# Altium project ATmega_2560_Pro.PrjPcb (part 2 of 4)
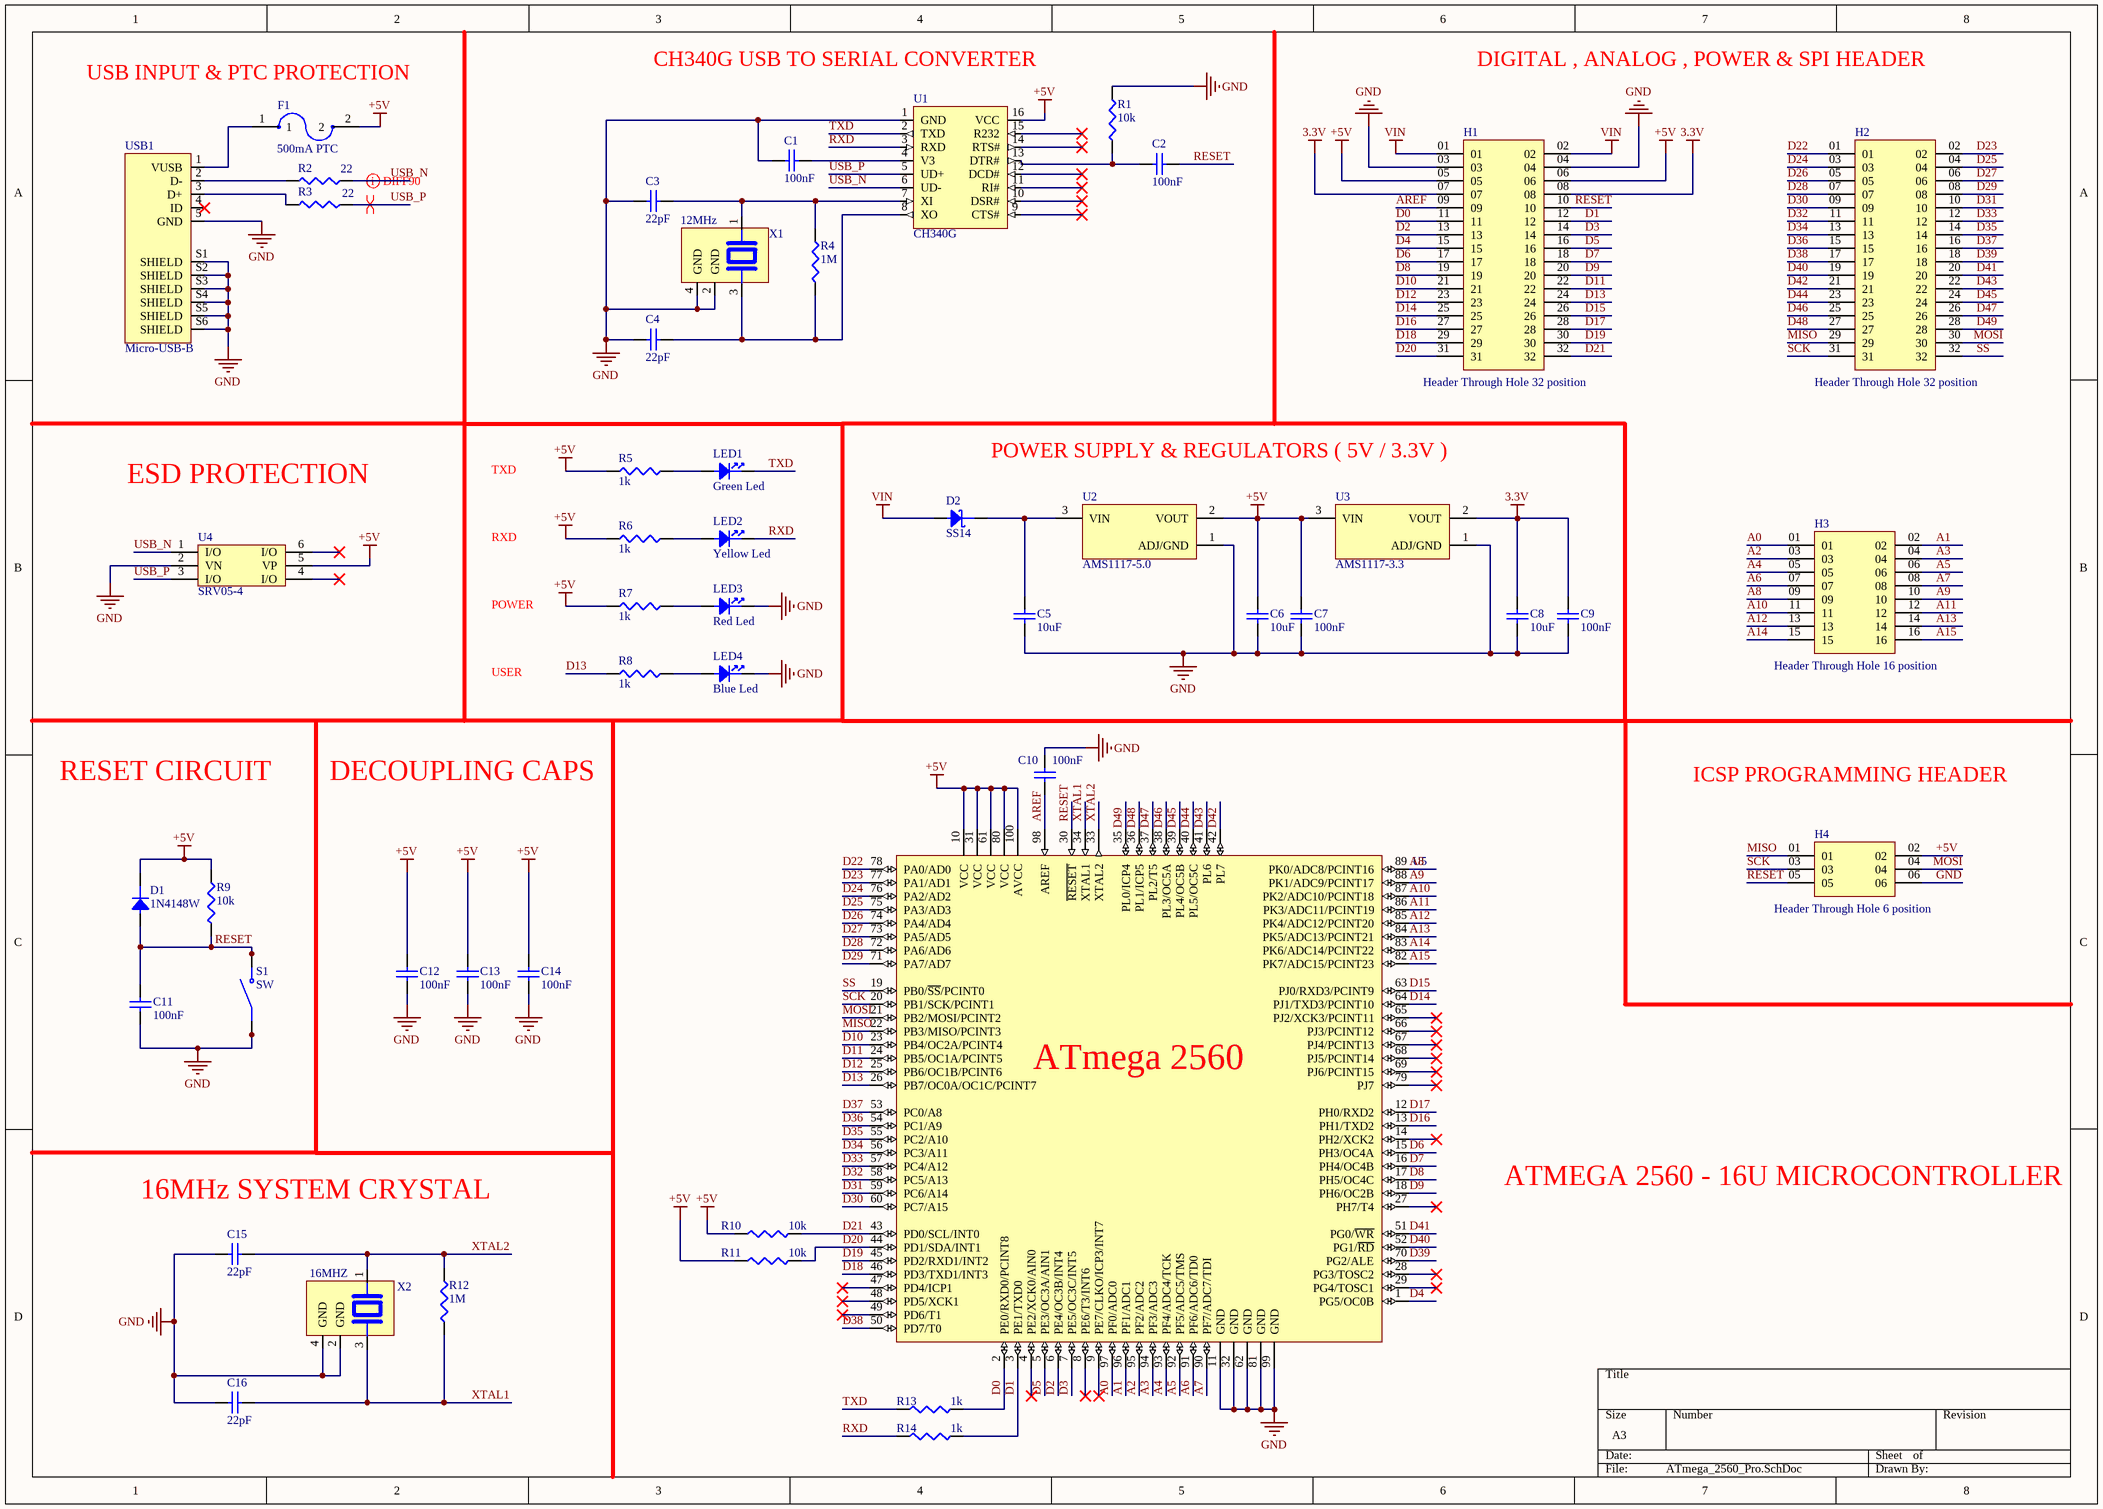
[diagram p1: ATmega_2560_Pro.SchDoc]

## Sheet ATmega_2560_Pro.SchDoc (continued)
### Library data of the parts
C1 C2 C7 C9-C14 = CC0603KRX7R9BB104: CAP CER 0.1UF 50V X7R 0603; Manufacturer 1: Yageo Group; Dielectric Material: Ceramic; Tolerance: 10%; Supplier 1: DigiKey; Manufacturer Part Number 1: CC0603KRX7R9BB104; Stock 1: 13983; Pricing 1: 1=0.14, 10=0.08, 50=0.0554, 100=0.0478, 500=0.03526 (USD); RoHS: Compliant; Value: 100nF; Case/Package: 0603; Case Code (Imperial): 0603; Case Code (Metric): 1608; China RoHS: Compliant; Country of Origin: Mainland China, Taiwan; Depth: 800µm; Dielectric: X7R; Export Control Classification Number (ECCN) Code: EAR99; Halogen Free: Halogen Free; Height: 800µm; Harmonized Tariff Schedule (HTS) Code: 8532.24.00.20; Introduction Date: 2005-08-18; Lead Free: Lead Free; Length: 1.6mm; Lifecycle Status: Production; Material: Ceramic; Max Operating Temperature: 125°C; Min Operating Temperature: -55°C; Mounting Technology: Surface Mount; Pins: 2; Number of Terminals: 2; Radiation Hardening: No; REACH SVHC: Unaffected; Schedule B: 8532240020, 8532240020|8532240020, 8532240020|8532240020|8532240020, 8532240020|8532240020|8532240020|8532240020; Termination: SMD/SMT; Thickness: 889µm; Voltage: 50V; Voltage Rating: 50V; Voltage Rating (DC): 50V; Width: 800µm; ComponentLink1URL: https://datasheet.octopart.com:443/CC0603KRX7R9BB104-Yageo-datasheet-177165144.pdf?src-supplier=IHS; ComponentLink1Description: https://datasheet.octopart.com:443/CC0603KRX7R9BB104-Yageo-datasheet-177165144.pdf?src-supplier=IHS; ComponentLink2URL: https://datasheet.octopart.com:443/CC0603KRX7R9BB104-Yageo-datasheet-82288757.pdf?src-supplier=Upverter; ComponentLink2Description: https://datasheet.octopart.com:443/CC0603KRX7R9BB104-Yageo-datasheet-82288757.pdf?src-supplier=Upverter; ComponentLink3URL: https://datasheet.octopart.com:443/CC0603KRX7R9BB104-Yageo-datasheet-68298032.pdf?src-supplier=Upverter; ComponentLink3Description: https://datasheet.octopart.com:443/CC0603KRX7R9BB104-Yageo-datasheet-68298032.pdf?src-supplier=Upverter; ComponentLink4URL: https://datasheet.octopart.com/CC0603KRX7R9BB104-Yageo-datasheet-10883670.pdf; ComponentLink4Description: https://datasheet.octopart.com/CC0603KRX7R9BB104-Yageo-datasheet-10883670.pdf; ComponentLink5URL: https://datasheet.octopart.com:443/CC0603KRX7R9BB104-Yageo-datasheet-181968726.pdf?src-supplier=Newark; ComponentLink5Description: https://datasheet.octopart.com:443/CC0603KRX7R9BB104-Yageo-datasheet-181968726.pdf?src-supplier=Newark; ComponentLink6URL: https://datasheet.octopart.com:443/CC0603KRX7R9BB104-Yageo-datasheet-499490.pdf?src-supplier=Newark; ComponentLink6Description: https://datasheet.octopart.com:443/CC0603KRX7R9BB104-Yageo-datasheet-499490.pdf?src-supplier=Newark; ComponentLink7URL: https://datasheet.octopart.com:443/CC0603KRX7R9BB104-Yageo-datasheet-62336348.pdf?src-supplier=Newark; ComponentLink7Description: https://datasheet.octopart.com:443/CC0603KRX7R9BB104-Yageo-datasheet-62336348.pdf?src-supplier=Newark; ComponentLink8URL: https://datasheet.octopart.com:443/CC0603KRX7R9BB104-Yageo-datasheet-147453679.pdf?src-supplier=Newark; ComponentLink8Description: https://datasheet.octopart.com:443/CC0603KRX7R9BB104-Yageo-datasheet-147453679.pdf?src-supplier=Newark; ComponentLink9URL: https://datasheet.octopart.com:443/CC0603KRX7R9BB104-Yageo-datasheet-151948686.pdf?src-supplier=Farnell; ComponentLink9Description: https://datasheet.octopart.com:443/CC0603KRX7R9BB104-Yageo-datasheet-151948686.pdf?src-supplier=Farnell; ComponentLink10URL: https://datasheet.octopart.com:443/CC0603KRX7R9BB104-Yageo-datasheet-500777.pdf?src-supplier=Farnell; ComponentLink10Description: https://datasheet.octopart.com:443/CC0603KRX7R9BB104-Yageo-datasheet-500777.pdf?src-supplier=Farnell; ComponentLink11URL: https://datasheet.octopart.com:443/CC0603KRX7R9BB104-Yageo-datasheet-12526321.pdf?src-supplier=Future+Electronics; ComponentLink11Description: https://datasheet.octopart.com:443/CC0603KRX7R9BB104-Yageo-datasheet-12526321.pdf?src-supplier=Future+Electronics; ComponentLink12URL: https://datasheet.octopart.com:443/CC0603KRX7R9BB104-Yageo-Group-datasheet-189192896.pdf?src-supplier=Future+Electronics; ComponentLink12Description: https://datasheet.octopart.com:443/CC0603KRX7R9BB104-Yageo-Group-datasheet-189192896.pdf?src-supplier=Future+Electronics; ComponentLink13URL: https://datasheet.octopart.com:443/CC0603KRX7R9BB104-Yageo-datasheet-166511530.pdf?src-supplier=Future+Electronics; ComponentLink13Description: https://datasheet.octopart.com:443/CC0603KRX7R9BB104-Yageo-datasheet-166511530.pdf?src-supplier=Future+Electronics; ComponentLink14URL: https://datasheet.octopart.com:443/CC0603KRX7R9BB104-Yageo-datasheet-137700082.pdf?src-supplier=Future+Electronics; ComponentLink14Description: https://datasheet.octopart.com:443/CC0603KRX7R9BB104-Yageo-datasheet-137700082.pdf?src-supplier=Future+Electronics; ComponentLink15URL: https://datasheet.octopart.com:443/CC0603KRX7R9BB104-Yageo-datasheet-137700084.pdf?src-supplier=Future+Electronics; ComponentLink15Description: https://datasheet.octopart.com:443/CC0603KRX7R9BB104-Yageo-datasheet-137700084.pdf?src-supplier=Future+Electronics; ComponentLink16URL: https://datasheet.octopart.com:443/CC0603KRX7R9BB104-Yageo-datasheet-27626582.pdf?src-supplier=Future+Electronics; ComponentLink16Description: https://datasheet.octopart.com:443/CC0603KRX7R9BB104-Yageo-datasheet-27626582.pdf?src-supplier=Future+Electronics; ComponentLink17URL: https://datasheet.octopart.com:443/CC0603KRX7R9BB104-Yageo-datasheet-15895757.pdf?src-supplier=Future+Electronics; ComponentLink17Description: https://datasheet.octopart.com:443/CC0603KRX7R9BB104-Yageo-datasheet-15895757.pdf?src-supplier=Future+Electronics; ComponentLink18URL: https://datasheet.octopart.com:443/CC0603KRX7R9BB104-Yageo-datasheet-8324192.pdf?src-supplier=Future+Electronics; ComponentLink18Description: https://datasheet.octopart.com:443/CC0603KRX7R9BB104-Yageo-datasheet-8324192.pdf?src-supplier=Future+Electronics; ComponentLink19URL: https://datasheet.octopart.com:443/CC0603KRX7R9BB104-Yageo-datasheet-178019014.pdf?src-supplier=Burklin+Elektronik; ComponentLink19Description: https://datasheet.octopart.com:443/CC0603KRX7R9BB104-Yageo-datasheet-178019014.pdf?src-supplier=Burklin+Elektronik; ComponentLink20URL: https://datasheet.octopart.com:443/CC0603KRX7R9BB104-Yageo-Group-datasheet-165992755.pdf?src-supplier=ODG+(Origin+Data+Global); ComponentLink20Description: https://datasheet.octopart.com:443/CC0603KRX7R9BB104-Yageo-Group-datasheet-165992755.pdf?src-supplier=ODG+(Origin+Data+Global); ComponentLink21URL: https://datasheet.octopart.com:443/CC0603KRX7R9BB104-Yageo-datasheet-140260305.pdf?src-supplier=SOS+electronic; ComponentLink21Description: https://datasheet.octopart.com:443/CC0603KRX7R9BB104-Yageo-datasheet-140260305.pdf?src-supplier=SOS+electronic; ComponentLink22URL: https://datasheet.octopart.com:443/CC0603KRX7R9BB104-Yageo-datasheet-120101875.pdf?src-supplier=Megastar; ComponentLink22Description: https://datasheet.octopart.com:443/CC0603KRX7R9BB104-Yageo-datasheet-120101875.pdf?src-supplier=Megastar; ComponentLink23URL: https://datasheet.octopart.com:443/CC0603KRX7R9BB104-Yageo-datasheet-8701427.pdf?src-supplier=element14; ComponentLink23Description: https://datasheet.octopart.com:443/CC0603KRX7R9BB104-Yageo-datasheet-8701427.pdf?src-supplier=element14; ComponentLink24URL: https://datasheet.octopart.com:443/CC0603KRX7R9BB104-Yageo-datasheet-5301394.pdf?src-supplier=element14; ComponentLink24Description: https://datasheet.octopart.com:443/CC0603KRX7R9BB104-Yageo-datasheet-5301394.pdf?src-supplier=element14; ComponentLink25URL: https://datasheet.octopart.com:443/CC0603KRX7R9BB104-Yageo-datasheet-17600895.pdf?src-supplier=TME; ComponentLink25Description: https://datasheet.octopart.com:443/CC0603KRX7R9BB104-Yageo-datasheet-17600895.pdf?src-supplier=TME; ComponentLink26URL: http://sigma.octopart.com:80/15889575/rohs_statement/Yageo-CC0603KRX7R9BB104.pdf?src-supplier=Compliance+Statements; ComponentLink26Description: http://sigma.octopart.com:80/15889575/rohs_statement/Yageo-CC0603KRX7R9BB104.pdf?src-supplier=Compliance+Statements; ComponentLink27URL: http://sigma.octopart.com:80/conflict_mineral_statement/Yageo-company-3.pdf?src-supplier=Compliance+Statements; ComponentLink27Description: http://sigma.octopart.com:80/conflict_mineral_statement/Yageo-company-3.pdf?src-supplier=Compliance+Statements; Supplier Part Number 1: 311-1344-6-ND
C3 C4 C15 C16 = CC0603JRNPO9BN220: CAP CER 22PF 50V C0G/NPO 0603; Manufacturer 1: Yageo Group; Dielectric: C0G; Dielectric Material: Ceramic; Temperature Coefficient: 30ppm/°C; Tolerance: 5%; Supplier 1: DigiKey; Manufacturer Part Number 1: CC0603JRNPO9BN220; Stock 1: 876; Pricing 1: 1=0.11, 10=0.057, 50=0.039, 100=0.0334, 500=0.02416 (USD); RoHS: Compliant; Value: 22pF; Case/Package: 0603; Case Code (Imperial): 0603; Case Code (Metric): 1608; China RoHS: Compliant; Country of Origin: Mainland China, Taiwan; Depth: 800µm; Export Control Classification Number (ECCN) Code: EAR99; Halogen Free: Halogen Free; Height: 800µm; Harmonized Tariff Schedule (HTS) Code: 8532.24.00.20; Introduction Date: 2003-08-13; Lead Free: Lead Free; Length: 1.6mm; Lifecycle Status: Production; Max Operating Temperature: 125°C; Min Operating Temperature: -55°C; Mounting Technology: Surface Mount; Pins: 2; Number of Terminals: 2; Radiation Hardening: No; REACH SVHC: Unaffected; Schedule B: 8532240020, 8532240020|8532240020, 8532240020|8532240020|8532240020, 8532240020|8532240020|8532240020|8532240020; Termination: SMD/SMT; Thickness: 889µm; Voltage: 50V; Voltage Rating: 50V; Voltage Rating (AC): 50V; Voltage Rating (DC): 50V; Width: 800µm; ComponentLink1URL: https://datasheet.octopart.com:443/CC0603JRNPO9BN220-Yageo-datasheet-182140217.pdf?src-supplier=IHS; ComponentLink1Description: https://datasheet.octopart.com:443/CC0603JRNPO9BN220-Yageo-datasheet-182140217.pdf?src-supplier=IHS; ComponentLink2URL: https://datasheet.octopart.com:443/CC0603JRNPO9BN220-Yageo-datasheet-10406438.pdf?src-supplier=element14+APAC; ComponentLink2Description: https://datasheet.octopart.com:443/CC0603JRNPO9BN220-Yageo-datasheet-10406438.pdf?src-supplier=element14+APAC; ComponentLink3URL: https://datasheet.octopart.com:443/CC0603JRNPO9BN220-Yageo-datasheet-10882999.pdf?src-supplier=element14+APAC; ComponentLink3Description: https://datasheet.octopart.com:443/CC0603JRNPO9BN220-Yageo-datasheet-10882999.pdf?src-supplier=element14+APAC; ComponentLink4URL: https://datasheet.octopart.com:443/CC0603JRNPO9BN220-Yageo-datasheet-78855684.pdf?src-supplier=Upverter; ComponentLink4Description: https://datasheet.octopart.com:443/CC0603JRNPO9BN220-Yageo-datasheet-78855684.pdf?src-supplier=Upverter; ComponentLink5URL: https://datasheet.octopart.com:443/CC0603JRNPO9BN220-Yageo---Phycomp-datasheet-141445762.pdf?src-supplier=Upverter; ComponentLink5Description: https://datasheet.octopart.com:443/CC0603JRNPO9BN220-Yageo---Phycomp-datasheet-141445762.pdf?src-supplier=Upverter; ComponentLink6URL: https://datasheet.octopart.com:443/CC0603JRNPO9BN220-Yageo-Group-datasheet-192360829.pdf?src-supplier=Future+Electronics; ComponentLink6Description: https://datasheet.octopart.com:443/CC0603JRNPO9BN220-Yageo-Group-datasheet-192360829.pdf?src-supplier=Future+Electronics; ComponentLink7URL: https://datasheet.octopart.com:443/CC0603JRNPO9BN220-Yageo-datasheet-12589826.pdf?src-supplier=Future+Electronics; ComponentLink7Description: https://datasheet.octopart.com:443/CC0603JRNPO9BN220-Yageo-datasheet-12589826.pdf?src-supplier=Future+Electronics; ComponentLink8URL: https://datasheet.octopart.com:443/CC0603JRNPO9BN220-Yageo-datasheet-137875056.pdf?src-supplier=Future+Electronics; ComponentLink8Description: https://datasheet.octopart.com:443/CC0603JRNPO9BN220-Yageo-datasheet-137875056.pdf?src-supplier=Future+Electronics; ComponentLink9URL: https://datasheet.octopart.com:443/CC0603JRNPO9BN220-Yageo-datasheet-136957424.pdf?src-supplier=Future+Electronics; ComponentLink9Description: https://datasheet.octopart.com:443/CC0603JRNPO9BN220-Yageo-datasheet-136957424.pdf?src-supplier=Future+Electronics; ComponentLink10URL: https://datasheet.octopart.com:443/CC0603JRNPO9BN220-Yageo-datasheet-137700082.pdf?src-supplier=Future+Electronics; ComponentLink10Description: https://datasheet.octopart.com:443/CC0603JRNPO9BN220-Yageo-datasheet-137700082.pdf?src-supplier=Future+Electronics; ComponentLink11URL: https://datasheet.octopart.com:443/CC0603JRNPO9BN220-Yageo-datasheet-62091628.pdf?src-supplier=Future+Electronics; ComponentLink11Description: https://datasheet.octopart.com:443/CC0603JRNPO9BN220-Yageo-datasheet-62091628.pdf?src-supplier=Future+Electronics; ComponentLink12URL: https://datasheet.octopart.com:443/CC0603JRNPO9BN220-Yageo-datasheet-16730043.pdf?src-supplier=Future+Electronics; ComponentLink12Description: https://datasheet.octopart.com:443/CC0603JRNPO9BN220-Yageo-datasheet-16730043.pdf?src-supplier=Future+Electronics; ComponentLink13URL: https://datasheet.octopart.com:443/CC0603JRNPO9BN220-Yageo-datasheet-15895757.pdf?src-supplier=Future+Electronics; ComponentLink13Description: https://datasheet.octopart.com:443/CC0603JRNPO9BN220-Yageo-datasheet-15895757.pdf?src-supplier=Future+Electronics; ComponentLink14URL: https://datasheet.octopart.com:443/CC0603JRNPO9BN220-Yageo-datasheet-151948684.pdf?src-supplier=Newark; ComponentLink14Description: https://datasheet.octopart.com:443/CC0603JRNPO9BN220-Yageo-datasheet-151948684.pdf?src-supplier=Newark; ComponentLink15URL: https://datasheet.octopart.com:443/CC0603JRNPO9BN220-Phycomp-datasheet-504625.pdf?src-supplier=Newark; ComponentLink15Description: https://datasheet.octopart.com:443/CC0603JRNPO9BN220-Phycomp-datasheet-504625.pdf?src-supplier=Newark; ComponentLink16URL: https://datasheet.octopart.com:443/CC0603JRNPO9BN220-Yageo-datasheet-181968203.pdf?src-supplier=Newark; ComponentLink16Description: https://datasheet.octopart.com:443/CC0603JRNPO9BN220-Yageo-datasheet-181968203.pdf?src-supplier=Newark; ComponentLink17URL: https://datasheet.octopart.com:443/CC0603JRNPO9BN220-Yageo-datasheet-24578986.pdf?src-supplier=Newark; ComponentLink17Description: https://datasheet.octopart.com:443/CC0603JRNPO9BN220-Yageo-datasheet-24578986.pdf?src-supplier=Newark; ComponentLink18URL: https://datasheet.octopart.com:443/CC0603JRNPO9BN220-Yageo-datasheet-67645495.pdf?src-supplier=Newark; ComponentLink18Description: https://datasheet.octopart.com:443/CC0603JRNPO9BN220-Yageo-datasheet-67645495.pdf?src-supplier=Newark; ComponentLink19URL: https://datasheet.octopart.com:443/CC0603JRNPO9BN220-Yageo-datasheet-65873193.pdf?src-supplier=Farnell; ComponentLink19Description: https://datasheet.octopart.com:443/CC0603JRNPO9BN220-Yageo-datasheet-65873193.pdf?src-supplier=Farnell; ComponentLink20URL: https://datasheet.octopart.com:443/CC0603JRNPO9BN220-Yageo-Group-datasheet-188689597.pdf?src-supplier=Farnell; ComponentLink20Description: https://datasheet.octopart.com:443/CC0603JRNPO9BN220-Yageo-Group-datasheet-188689597.pdf?src-supplier=Farnell; ComponentLink21URL: https://datasheet.octopart.com:443/CC0603JRNPO9BN220-Yageo-datasheet-8817079.pdf?src-supplier=element14; ComponentLink21Description: https://datasheet.octopart.com:443/CC0603JRNPO9BN220-Yageo-datasheet-8817079.pdf?src-supplier=element14; ComponentLink22URL: https://datasheet.octopart.com:443/CC0603JRNPO9BN220-Yageo-datasheet-8324240.pdf?src-supplier=element14; ComponentLink22Description: https://datasheet.octopart.com:443/CC0603JRNPO9BN220-Yageo-datasheet-8324240.pdf?src-supplier=element14; ComponentLink23URL: https://datasheet.octopart.com:443/CC0603JRNPO9BN220-Yageo-datasheet-5321569.pdf?src-supplier=element14; ComponentLink23Description: https://datasheet.octopart.com:443/CC0603JRNPO9BN220-Yageo-datasheet-5321569.pdf?src-supplier=element14; ComponentLink24URL: https://datasheet.octopart.com:443/CC0603JRNPO9BN220-Yageo-datasheet-8643175.pdf?src-supplier=SOS+electronic; ComponentLink24Description: https://datasheet.octopart.com:443/CC0603JRNPO9BN220-Yageo-datasheet-8643175.pdf?src-supplier=SOS+electronic; ComponentLink25URL: https://datasheet.octopart.com:443/CC0603JRNPO9BN220-Yageo-datasheet-8555986.pdf?src-supplier=TME; ComponentLink25Description: https://datasheet.octopart.com:443/CC0603JRNPO9BN220-Yageo-datasheet-8555986.pdf?src-supplier=TME; ComponentLink26URL: https://datasheet.octopart.com:443/CC0603JRNPO9BN220-Yageo-datasheet-68296204.pdf?src-supplier=Megastar; ComponentLink26Description: https://datasheet.octopart.com:443/CC0603JRNPO9BN220-Yageo-datasheet-68296204.pdf?src-supplier=Megastar; ComponentLink27URL: http://sigma.octopart.com:80/conflict_mineral_statement/Yageo-company-3.pdf?src-supplier=Compliance+Statements; ComponentLink27Description: http://sigma.octopart.com:80/conflict_mineral_statement/Yageo-company-3.pdf?src-supplier=Compliance+Statements; ComponentLink28URL: http://sigma.octopart.com:80/rohs_statement/Yageo-company-2.pdf?src-supplier=Compliance+Statements; ComponentLink28Description: http://sigma.octopart.com:80/rohs_statement/Yageo-company-2.pdf?src-supplier=Compliance+Statements; Supplier Part Number 1: 311-1062-1-ND
C5 C6 C8 = CC0603MRX5R6BB106: CAP CER 10UF 10V X5R 0603; Manufacturer: Yageo Group; Value: 10µF; Dielectric Material: Ceramic; Tolerance: 20%; Supplier: DigiKey; Supplier Part Number: 311-1817-1-ND; Manufacturer Part Number: CC0603MRX5R6BB106; RoHS: Compliant; Category: Ceramic Capacitors; Stock: 2; Pricing: 1=0.43, 10=0.252, 50=0.1838, 100=0.1629, 500=0.12756 (USD); Case/Package: 0603; Case Code (Imperial): 0603; Case Code (Metric): 1608; China RoHS: Compliant; Composition: Ceramic; Country of Origin: Mainland China, Taiwan; Depth: 800µm; Dielectric: X5R; Export Control Classification Number (ECCN) Code: EAR99; Halogen Free: Halogen Free; Height: 800µm; Harmonized Tariff Schedule (HTS) Code: 8532.24.00.20; Introduction Date: 2013-02-05; Lead Free: Lead Free; Length: 1.6mm; Lifecycle Status: Production; Max Operating Temperature: 85°C; Min Operating Temperature: -55°C; Mounting Technology: Surface Mount; Number of Terminals: 2; Packaging: Tape and Reel; REACH SVHC: Unaffected; Schedule B: 8532240020, 8532240020|8532240020|8532240020|8532240020|8532240020|8532240020|8532240020|8532240020|8532240020|8532240020|8532240020|8532240020|8532240020|8532240020|8532240020, 8532240020|8532240020|8532240020|8532240020|8532240020|8532240020|8532240020|8532240020|8532240020|8532240020|8532240020|8532240020|8532240020|8532240020|8532240020|8532240020, 8532240020|8532240020|8532240020|8532240020|8532240020|8532240020|8532240020|8532240020|8532240020|8532240020|8532240020|8532240020|8532240020|8532240020|8532240020|8532240020|8532240020; Termination: SMD/SMT; Thickness: 889µm; Voltage Rating: 10V; Voltage Rating (DC): 10V; Weight: 2.012816mg; Width: 800µm; ComponentLink1URL: https://datasheet.octopart.com:443/CC0603MRX5R6BB106-Yageo-datasheet-170350636.pdf?src-supplier=IHS; ComponentLink1Description: https://datasheet.octopart.com:443/CC0603MRX5R6BB106-Yageo-datasheet-170350636.pdf?src-supplier=IHS; ComponentLink2URL: https://datasheet.octopart.com:443/CC0603MRX5R6BB106-Yageo-datasheet-181968810.pdf?src-supplier=Farnell; ComponentLink2Description: https://datasheet.octopart.com:443/CC0603MRX5R6BB106-Yageo-datasheet-181968810.pdf?src-supplier=Farnell; ComponentLink3URL: https://datasheet.octopart.com:443/CC0603MRX5R6BB106-Yageo-datasheet-181968808.pdf?src-supplier=Farnell; ComponentLink3Description: https://datasheet.octopart.com:443/CC0603MRX5R6BB106-Yageo-datasheet-181968808.pdf?src-supplier=Farnell; ComponentLink4URL: https://datasheet.octopart.com/CC0603MRX5R6BB106-Yageo-datasheet-86397281.pdf; ComponentLink4Description: https://datasheet.octopart.com/CC0603MRX5R6BB106-Yageo-datasheet-86397281.pdf; ComponentLink5URL: https://datasheet.octopart.com:443/CC0603MRX5R6BB106-Yageo-Group-datasheet-184398209.pdf?src-supplier=LCSC; ComponentLink5Description: https://datasheet.octopart.com:443/CC0603MRX5R6BB106-Yageo-Group-datasheet-184398209.pdf?src-supplier=LCSC; ComponentLink6URL: https://datasheet.octopart.com:443/CC0603MRX5R6BB106-Yageo-Group-datasheet-175963154.pdf?src-supplier=Newark; ComponentLink6Description: https://datasheet.octopart.com:443/CC0603MRX5R6BB106-Yageo-Group-datasheet-175963154.pdf?src-supplier=Newark; ComponentLink7URL: https://datasheet.octopart.com:443/CC0603MRX5R6BB106-Yageo-datasheet-158238148.pdf?src-supplier=Newark; ComponentLink7Description: https://datasheet.octopart.com:443/CC0603MRX5R6BB106-Yageo-datasheet-158238148.pdf?src-supplier=Newark; ComponentLink8URL: https://datasheet.octopart.com:443/CC0603MRX5R6BB106-Yageo-Group-datasheet-145016144.pdf?src-supplier=ODG+(Origin+Data+Global); ComponentLink8Description: https://datasheet.octopart.com:443/CC0603MRX5R6BB106-Yageo-Group-datasheet-145016144.pdf?src-supplier=ODG+(Origin+Data+Global); ComponentLink9URL: https://datasheet.octopart.com:443/CC0603MRX5R6BB106-Yageo-datasheet-137700082.pdf?src-supplier=Future+Electronics; ComponentLink9Description: https://datasheet.octopart.com:443/CC0603MRX5R6BB106-Yageo-datasheet-137700082.pdf?src-supplier=Future+Electronics; ComponentLink10URL: https://datasheet.octopart.com:443/CC0603MRX5R6BB106-Yageo-datasheet-78855687.pdf?src-supplier=Future+Electronics; ComponentLink10Description: https://datasheet.octopart.com:443/CC0603MRX5R6BB106-Yageo-datasheet-78855687.pdf?src-supplier=Future+Electronics; ComponentLink11URL: https://datasheet.octopart.com:443/CC0603MRX5R6BB106-Yageo-Group-datasheet-192360830.pdf?src-supplier=Future+Electronics; ComponentLink11Description: https://datasheet.octopart.com:443/CC0603MRX5R6BB106-Yageo-Group-datasheet-192360830.pdf?src-supplier=Future+Electronics; ComponentLink12URL: http://sigma.octopart.com:80/conflict_mineral_statement/Yageo-company-3.pdf?src-supplier=Compliance+Statements; ComponentLink12Description: http://sigma.octopart.com:80/conflict_mineral_statement/Yageo-company-3.pdf?src-supplier=Compliance+Statements; ComponentLink13URL: http://sigma.octopart.com:80/rohs_statement/Yageo-company-2.pdf?src-supplier=Compliance+Statements; ComponentLink13Description: http://sigma.octopart.com:80/rohs_statement/Yageo-company-2.pdf?src-supplier=Compliance+Statements
D1 = 1N4148W: DIODE STANDARD 75V 250MA SOD123; Manufacturer 1: Sangdest Microelectronics; Max Output current: 150mA; Max Power Dissipation: 410mW; Number of Elements: 1; Reverse Recovery Time: 4ns; Supplier 1: DigiKey; Manufacturer Part Number 1: 1N4148W; Stock 1: 266309; Pricing 1: 1=0.14, 10=0.083, 50=0.0592, 100=0.0512, 500=0.03694 (USD); RoHS: Compliant; Country of Origin: Mainland China; Export Control Classification Number (ECCN) Code: EAR99; Harmonized Tariff Schedule (HTS) Code: 8541.10.00.70; Introduction Date: 2003-01-15; Lifecycle Status: Production; Max Operating Temperature: 150°C; Number of Terminals: 2; REACH SVHC: Unaffected; Reverse Standoff Voltage: 75V; ComponentLink1URL: https://datasheet.octopart.com:443/1N4148W-SMC-Diode-Solutions-datasheet-181398799.pdf?src-supplier=IHS; ComponentLink1Description: https://datasheet.octopart.com:443/1N4148W-SMC-Diode-Solutions-datasheet-181398799.pdf?src-supplier=IHS; Supplier Part Number 1: 1655-1N4148WCT-ND
D2 = SS14: DIODE SCHOTTKY 40V 1A DO214AC; Manufacturer: Taiwan Semiconductor; Manufacturer Lifecycle Status: ACTIVE; Element Configuration: Single; Forward Voltage: 500mV; Max Forward Surge Current (Ifsm): 40A; Max Junction Temperature (Tj): 125°C; Max Reverse Leakage Current: 200µA; Max Surge Current: 30A; Number of Elements: 1; Polarity: Standard; Power Dissipation: 400mW; Reverse Recovery Time: 25ns; Supplier: DigiKey; Supplier Part Number: 1801-SS14CT-ND; Manufacturer Part Number: SS14; RoHS: Compliant; Category: Schottky Diodes; Stock: 63885; Pricing: 1=0.39, 10=0.236, 50=0.1698, 100=0.148, 500=0.1096 (USD); Case/Package: SMA; China RoHS: Non-Compliant; Contact Plating: Tin; Country of Origin: Mainland China, Taiwan; Current Rating: 1A; Export Control Classification Number (ECCN) Code: EAR99; Forward Current: 1A; Harmonized Tariff Schedule (HTS) Code: 8541.10.00.80; Introduction Date: 1998-01-20; Lead Free: Lead Free; Lifecycle Status: Production; Max Operating Temperature: 125°C; Max Output current: 1A; Max Repetitive Reverse Voltage (Vrrm): 40V; Min Breakdown Voltage: 40V; Min Operating Temperature: -65°C; Mounting Technology: Surface Mount; Pins: 2; Number of Terminals: 2; Output Current: 1A; Packaging: Cut Tape; Peak Non-Repetitive Surge Current: 30A; Peak Reverse Current: 200µA; REACH SVHC: Affected; Reverse Standoff Voltage: 40V; Schedule B: 8541100080, 8541100080|8541100080|8541100080|8541100080|8541100080; Voltage Rating (DC): 40V; ComponentLink1URL: https://datasheet.octopart.com:443/SS14-Taiwan-Semiconductor-datasheet-179284502.pdf?src-supplier=IHS; ComponentLink1Description: https://datasheet.octopart.com:443/SS14-Taiwan-Semiconductor-datasheet-179284502.pdf?src-supplier=IHS; ComponentLink2URL: https://datasheet.octopart.com:443/SS14-Taiwan-Semiconductor-datasheet-181551144.pdf?src-supplier=IHS; ComponentLink2Description: https://datasheet.octopart.com:443/SS14-Taiwan-Semiconductor-datasheet-181551144.pdf?src-supplier=IHS; ComponentLink3URL: https://datasheet.octopart.com:443/SS14-Taiwan-Semiconductor-datasheet-180789182.pdf?src-supplier=IHS; ComponentLink3Description: https://datasheet.octopart.com:443/SS14-Taiwan-Semiconductor-datasheet-180789182.pdf?src-supplier=IHS; ComponentLink4URL: https://datasheet.octopart.com:443/SS14-Taiwan-Semiconductor-datasheet-182397600.pdf?src-supplier=IHS; ComponentLink4Description: https://datasheet.octopart.com:443/SS14-Taiwan-Semiconductor-datasheet-182397600.pdf?src-supplier=IHS; ComponentLink5URL: https://datasheet.octopart.com:443/SS14-Taiwan-Semiconductor-datasheet-68472387.pdf?src-supplier=Taiwan+Semiconductor; ComponentLink5Description: https://datasheet.octopart.com:443/SS14-Taiwan-Semiconductor-datasheet-68472387.pdf?src-supplier=Taiwan+Semiconductor; ComponentLink6URL: https://datasheet.octopart.com:443/SS14-Taiwan-Semiconductor-datasheet-34355587.pdf?src-supplier=Taiwan+Semiconductor; ComponentLink6Description: https://datasheet.octopart.com:443/SS14-Taiwan-Semiconductor-datasheet-34355587.pdf?src-supplier=Taiwan+Semiconductor; ComponentLink7URL: https://datasheet.octopart.com:443/SS14-Taiwan-Semiconductor-datasheet-152739498.pdf?src-supplier=Farnell; ComponentLink7Description: https://datasheet.octopart.com:443/SS14-Taiwan-Semiconductor-datasheet-152739498.pdf?src-supplier=Farnell; ComponentLink8URL: https://datasheet.octopart.com:443/SS14-Taiwan-Semiconductor-datasheet-13727340.pdf?src-supplier=Newark; ComponentLink8Description: https://datasheet.octopart.com:443/SS14-Taiwan-Semiconductor-datasheet-13727340.pdf?src-supplier=Newark; ComponentLink9URL: https://datasheet.octopart.com:443/SS14-Taiwan-Semiconductor-datasheet-11549383.pdf?src-supplier=JRH+Electronics; ComponentLink9Description: https://datasheet.octopart.com:443/SS14-Taiwan-Semiconductor-datasheet-11549383.pdf?src-supplier=JRH+Electronics; ComponentLink10URL: https://datasheet.octopart.com:443/SS14-Taiwan-Semiconductor-datasheet-8823.pdf?src-supplier=Mouser; ComponentLink10Description: https://datasheet.octopart.com:443/SS14-Taiwan-Semiconductor-datasheet-8823.pdf?src-supplier=Mouser
F1 = MF-MSMF050-2: PTC RESET FUSE 15V 500MA 1812; Manufacturer: Bourns; Approvals: CSA, TUV, UL; Current Rating: 100A; Power Dissipation: 800mW; Ratings: AEC-Q200, TUV; Value: 150mΩ; Time to Trip: 150ms; Trip Current: 1A; Supplier: DigiKey; Supplier Part Number: MF-MSMF050-2CT-ND; Manufacturer Part Number: MF-MSMF050-2; RoHS: Compliant; Category: Fuses; Stock: 72264; Pricing: 1=0.38, 5=0.314, 10=0.29, 50=0.2402, 100=0.2216, 250=0.19928, 500=0.18382, 1000=0.16954 (USD); Ambient Temperature Range High: 85°C; Case/Package: 1812; Case Code (Imperial): 1812; Case Code (Metric): 4532; China RoHS: Compliant; Contact Plating: Gold; Export Control Classification Number (ECCN) Code: EAR99; Height: 850µm; Hold Current: 500mA; Harmonized Tariff Schedule (HTS) Code: 8533.40.80.70; Introduction Date: 2003-09-09; Lead Free: Lead Free; Length: 4.73mm; Lifecycle Status: Production; Max Current Rating: 100A; Max Operating Temperature: 85°C; Min Operating Temperature: -40°C; Mounting Technology: Surface Mount; Pins: 2; Number of Terminals: 2; Operating Supply Voltage: 15V; Radiation Hardening: No; REACH SVHC: Unaffected; Schedule B: 8536100040, 8536100040|8536100040, 8536100040|8536100040|8536100040, 8536100040|8536100040|8536100040|8536100040; Terminal Material: Gold; Termination: SMD/SMT; Voltage Rating: 15V; Voltage Rating (DC): 15V; Width: 3.41mm; Working Voltage: 15V; ComponentLink1URL: https://datasheet.octopart.com:443/MF-MSMF050-2-Bourns-datasheet-181955250.pdf?src-supplier=IHS; ComponentLink1Description: https://datasheet.octopart.com:443/MF-MSMF050-2-Bourns-datasheet-181955250.pdf?src-supplier=IHS; ComponentLink2URL: https://datasheet.octopart.com:443/MF-MSMF050-2-Bourns-datasheet-134530216.pdf?src-supplier=Electro+Sonic; ComponentLink2Description: https://datasheet.octopart.com:443/MF-MSMF050-2-Bourns-datasheet-134530216.pdf?src-supplier=Electro+Sonic; ComponentLink3URL: https://datasheet.octopart.com:443/MF-MSMF050-2-Bourns-datasheet-192480583.pdf?src-supplier=Electro+Sonic; ComponentLink3Description: https://datasheet.octopart.com:443/MF-MSMF050-2-Bourns-datasheet-192480583.pdf?src-supplier=Electro+Sonic; ComponentLink4URL: https://datasheet.octopart.com:443/MF-MSMF050-2-Bourns-datasheet-10413427.pdf?src-supplier=Electro+Sonic; ComponentLink4Description: https://datasheet.octopart.com:443/MF-MSMF050-2-Bourns-datasheet-10413427.pdf?src-supplier=Electro+Sonic; ComponentLink5URL: https://datasheet.octopart.com:443/MF-MSMF050-2-Bourns-datasheet-68302778.pdf?src-supplier=Electro+Sonic; ComponentLink5Description: https://datasheet.octopart.com:443/MF-MSMF050-2-Bourns-datasheet-68302778.pdf?src-supplier=Electro+Sonic; ComponentLink6URL: https://datasheet.octopart.com:443/MF-MSMF050-2-Bourns-datasheet-28511.pdf?src-supplier=Upverter; ComponentLink6Description: https://datasheet.octopart.com:443/MF-MSMF050-2-Bourns-datasheet-28511.pdf?src-supplier=Upverter; ComponentLink7URL: https://datasheet.octopart.com:443/MF-MSMF050-2-Bourns-datasheet-21630810.pdf?src-supplier=element14+APAC; ComponentLink7Description: https://datasheet.octopart.com:443/MF-MSMF050-2-Bourns-datasheet-21630810.pdf?src-supplier=element14+APAC; ComponentLink8URL: https://datasheet.octopart.com:443/MF-MSMF050-2-Bourns-datasheet-81453701.pdf?src-supplier=element14+APAC; ComponentLink8Description: https://datasheet.octopart.com:443/MF-MSMF050-2-Bourns-datasheet-81453701.pdf?src-supplier=element14+APAC; ComponentLink9URL: https://datasheet.octopart.com:443/MF-MSMF050-2-Bourns-datasheet-14703700.pdf?src-supplier=element14+APAC; ComponentLink9Description: https://datasheet.octopart.com:443/MF-MSMF050-2-Bourns-datasheet-14703700.pdf?src-supplier=element14+APAC; ComponentLink10URL: https://datasheet.octopart.com:443/MF-MSMF050-2-Bourns-datasheet-62100945.pdf?src-supplier=element14+APAC; ComponentLink10Description: https://datasheet.octopart.com:443/MF-MSMF050-2-Bourns-datasheet-62100945.pdf?src-supplier=element14+APAC; ComponentLink11URL: https://datasheet.octopart.com:443/MF-MSMF050-2..-Bourns-datasheet-66614317.pdf?src-supplier=element14+APAC; ComponentLink11Description: https://datasheet.octopart.com:443/MF-MSMF050-2..-Bourns-datasheet-66614317.pdf?src-supplier=element14+APAC; ComponentLink12URL: https://datasheet.octopart.com:443/MF-MSMF050-2-Bourns-datasheet-8700572.pdf?src-supplier=Factory+Futures; ComponentLink12Description: https://datasheet.octopart.com:443/MF-MSMF050-2-Bourns-datasheet-8700572.pdf?src-supplier=Factory+Futures; ComponentLink13URL: https://datasheet.octopart.com:443/MF-MSMF050-2-Bourns-datasheet-8482680.pdf?src-supplier=Factory+Futures; ComponentLink13Description: https://datasheet.octopart.com:443/MF-MSMF050-2-Bourns-datasheet-8482680.pdf?src-supplier=Factory+Futures; ComponentLink14URL: https://datasheet.octopart.com:443/MF-MSMF050-2-Bourns-datasheet-182689041.pdf?src-supplier=JRH+Electronics; ComponentLink14Description: https://datasheet.octopart.com:443/MF-MSMF050-2-Bourns-datasheet-182689041.pdf?src-supplier=JRH+Electronics; ComponentLink15URL: https://datasheet.octopart.com:443/MF-MSMF050-2-Bourns-datasheet-16807568.pdf?src-supplier=Farnell; ComponentLink15Description: https://datasheet.octopart.com:443/MF-MSMF050-2-Bourns-datasheet-16807568.pdf?src-supplier=Farnell; ComponentLink16URL: https://datasheet.octopart.com:443/MF-MSMF050-2-Bourns-datasheet-9622583.pdf?src-supplier=RS+(Formerly+Allied+Electronics); ComponentLink16Description: https://datasheet.octopart.com:443/MF-MSMF050-2-Bourns-datasheet-9622583.pdf?src-supplier=RS+(Formerly+Allied+Electronics); ComponentLink17URL: https://datasheet.octopart.com:443/MF-MSMF050-2-Bourns-datasheet-28695.pdf?src-supplier=RS+(Formerly+Allied+Electronics); ComponentLink17Description: https://datasheet.octopart.com:443/MF-MSMF050-2-Bourns-datasheet-28695.pdf?src-supplier=RS+(Formerly+Allied+Electronics); ComponentLink18URL: https://datasheet.octopart.com:443/MF-MSMF050-2-Bourns-datasheet-10424058.pdf?src-supplier=Jameco+(USA); ComponentLink18Description: https://datasheet.octopart.com:443/MF-MSMF050-2-Bourns-datasheet-10424058.pdf?src-supplier=Jameco+(USA); ComponentLink19URL: https://datasheet.octopart.com:443/MF-MSMF050-2-Bourns-datasheet-15141.pdf?src-supplier=Mouser; ComponentLink19Description: https://datasheet.octopart.com:443/MF-MSMF050-2-Bourns-datasheet-15141.pdf?src-supplier=Mouser; ComponentLink20URL: http://sigma.octopart.com:80/15889809/rohs_statement/Bourns-MF-MSMF050-2.pdf?src-supplier=Compliance+Statements; ComponentLink20Description: http://sigma.octopart.com:80/15889809/rohs_statement/Bourns-MF-MSMF050-2.pdf?src-supplier=Compliance+Statements; ComponentLink21URL: http://sigma.octopart.com:80/conflict_mineral_statement/Bourns-company-36.pdf?src-supplier=Compliance+Statements; ComponentLink21Description: http://sigma.octopart.com:80/conflict_mineral_statement/Bourns-company-36.pdf?src-supplier=Compliance+Statements
H1 H2 = TSW-116-07-G-D: Connector Header Through Hole 32 position 0.100" (2.54mm); Manufacturer: Samtec; Manufacturer Lifecycle Status: PRODUCTION; Connector Type: Male Pin; Gender: Male; Max Current Rating: 7.6A; Max Voltage Rating (AC): 550V; Number of Contacts: 32; Supplier: DigiKey; Supplier Part Number: 612-TSW-116-07-G-D-ND; Manufacturer Part Number: TSW-116-07-G-D; RoHS: Compliant; Category: Power Connectors; Stock: 463; Pricing: 1=3.91, 10=3.318, 100=2.82, 500=2.51726, 1000=2.3972 (USD); Color: Black; Contact Material: Bronze; Contact Mating Length: 5.842mm; Contact Plating: Gold; Depth: 5.08mm; Housing Color: Black; Housing Material: Polyester; Lead Free: Lead Free; Lead Pitch: 2.54mm; Length: 40.64mm; Lifecycle Status: Production; Max Operating Temperature: 125°C; Min Operating Temperature: -55°C; Mounting Technology: Through Hole; Number of Positions: 32; Number of Rows: 2; Orientation: Straight; Pitch: 2.54mm; Radiation Hardening: No; REACH SVHC: Unaffected; Row Spacing: 2.54mm; Termination: Solder; Width: 5.08mm; ComponentLink1URL: https://datasheet.octopart.com:443/TSW-116-07-G-D-Samtec-datasheet-97325576.pdf?src-supplier=Sager+Electronics; ComponentLink1Description: https://datasheet.octopart.com:443/TSW-116-07-G-D-Samtec-datasheet-97325576.pdf?src-supplier=Sager+Electronics; ComponentLink2URL: https://datasheet.octopart.com:443/TSW-116-07-G-D-Samtec-datasheet-151455181.pdf?src-supplier=Sager+Electronics; ComponentLink2Description: https://datasheet.octopart.com:443/TSW-116-07-G-D-Samtec-datasheet-151455181.pdf?src-supplier=Sager+Electronics; ComponentLink3URL: https://sigma.octopart.com:443/97325577/technical_drawing/Samtec-TSW-116-07-G-D.pdf?src-supplier=Samtec; ComponentLink3Description: https://sigma.octopart.com:443/97325577/technical_drawing/Samtec-TSW-116-07-G-D.pdf?src-supplier=Samtec; ComponentLink4URL: https://datasheet.octopart.com:443/TSW-116-07-G-D-Samtec-datasheet-136646178.pdf?src-supplier=Master+Electronics; ComponentLink4Description: https://datasheet.octopart.com:443/TSW-116-07-G-D-Samtec-datasheet-136646178.pdf?src-supplier=Master+Electronics; ComponentLink5URL: https://datasheet.octopart.com:443/TSW-116-07-G-D-Samtec-datasheet-118235302.pdf?src-supplier=Electro+Sonic; ComponentLink5Description: https://datasheet.octopart.com:443/TSW-116-07-G-D-Samtec-datasheet-118235302.pdf?src-supplier=Electro+Sonic; ComponentLink6URL: https://datasheet.octopart.com:443/TSW-116-07-G-D-Samtec-datasheet-182948906.pdf?src-supplier=JRH+Electronics; ComponentLink6Description: https://datasheet.octopart.com:443/TSW-116-07-G-D-Samtec-datasheet-182948906.pdf?src-supplier=JRH+Electronics; ComponentLink7URL: https://datasheet.octopart.com:443/TSW-116-07-G-D-Samtec-datasheet-160657603.pdf?src-supplier=Toby+Electronics; ComponentLink7Description: https://datasheet.octopart.com:443/TSW-116-07-G-D-Samtec-datasheet-160657603.pdf?src-supplier=Toby+Electronics; ComponentLink8URL: https://datasheet.octopart.com:443/TSW-116-07-G-D-Samtec-datasheet-116539033.pdf?src-supplier=Toby+Electronics; ComponentLink8Description: https://datasheet.octopart.com:443/TSW-116-07-G-D-Samtec-datasheet-116539033.pdf?src-supplier=Toby+Electronics; ComponentLink9URL: https://datasheet.octopart.com:443/TSW-116-07-G-D-Samtec-datasheet-116536310.pdf?src-supplier=Toby+Electronics; ComponentLink9Description: https://datasheet.octopart.com:443/TSW-116-07-G-D-Samtec-datasheet-116536310.pdf?src-supplier=Toby+Electronics; ComponentLink10URL: https://datasheet.octopart.com:443/TSW-116-07-G-D-.-Samtec-datasheet-138830914.pdf?src-supplier=Newark; ComponentLink10Description: https://datasheet.octopart.com:443/TSW-116-07-G-D-.-Samtec-datasheet-138830914.pdf?src-supplier=Newark; ComponentLink11URL: https://datasheet.octopart.com:443/TSW-116-07-G-D-Samtec-datasheet-112220187.pdf?src-supplier=Newark; ComponentLink11Description: https://datasheet.octopart.com:443/TSW-116-07-G-D-Samtec-datasheet-112220187.pdf?src-supplier=Newark; ComponentLink12URL: https://datasheet.octopart.com:443/TSW-116-07-G-D-Samtec-datasheet-11047283.pdf?src-supplier=Newark; ComponentLink12Description: https://datasheet.octopart.com:443/TSW-116-07-G-D-Samtec-datasheet-11047283.pdf?src-supplier=Newark; ComponentLink13URL: https://datasheet.octopart.com/TSW-116-07-G-D-Samtec-datasheet-86818365.pdf; ComponentLink13Description: https://datasheet.octopart.com/TSW-116-07-G-D-Samtec-datasheet-86818365.pdf; ComponentLink14URL: https://datasheet.octopart.com:443/TSW-116-07-G-D-Samtec-datasheet-11542832.pdf?src-supplier=Arrow+Electronics; ComponentLink14Description: https://datasheet.octopart.com:443/TSW-116-07-G-D-Samtec-datasheet-11542832.pdf?src-supplier=Arrow+Electronics
H3 = TSW-108-07-G-D: Connector Header Through Hole 16 position 0.100" (2.54mm); Manufacturer: Samtec; Manufacturer Lifecycle Status: PRODUCTION; Connector Type: Male Pin; Gender: Male; Max Current Rating: 7.6A; Max Voltage Rating (AC): 550V; Number of Contacts: 16; Supplier: DigiKey; Supplier Part Number: 612-TSW-108-07-G-D-ND; Manufacturer Part Number: TSW-108-07-G-D; RoHS: Compliant; Category: Headers and Wire Housings; Stock: 1851; Pricing: 1=1.34, 10=1.135, 100=0.9644, 500=0.8608, 1000=0.8197, 5000=0.73175, 10000=0.7275 (USD); Color: Black; Contact Material: Bronze; Contact Mating Length: 5.842mm; Contact Plating: Gold; Depth: 5.08mm; Housing Color: Black; Housing Material: Polyester; Lead Free: Lead Free; Lead Pitch: 2.54mm; Lifecycle Status: Production; Max Operating Temperature: 125°C; Min Operating Temperature: -55°C; Mounting Technology: Through Hole; Pins: 16; Number of Positions: 16; Number of Rows: 2; Orientation: Straight; Packaging: Bulk; Pitch: 2.54mm; Radiation Hardening: No; REACH SVHC: Unaffected; Row Spacing: 2.54mm; Termination: Solder; Width: 5.08mm; ComponentLink1URL: https://datasheet.octopart.com:443/TSW-108-07-G-D-Samtec-datasheet-97325576.pdf?src-supplier=Sager+Electronics; ComponentLink1Description: https://datasheet.octopart.com:443/TSW-108-07-G-D-Samtec-datasheet-97325576.pdf?src-supplier=Sager+Electronics; ComponentLink2URL: https://datasheet.octopart.com:443/TSW-108-07-G-D-Samtec-datasheet-151455181.pdf?src-supplier=Sager+Electronics; ComponentLink2Description: https://datasheet.octopart.com:443/TSW-108-07-G-D-Samtec-datasheet-151455181.pdf?src-supplier=Sager+Electronics; ComponentLink3URL: https://sigma.octopart.com:443/97325577/technical_drawing/Samtec-TSW-108-07-G-D.pdf?src-supplier=Samtec; ComponentLink3Description: https://sigma.octopart.com:443/97325577/technical_drawing/Samtec-TSW-108-07-G-D.pdf?src-supplier=Samtec; ComponentLink4URL: https://datasheet.octopart.com:443/TSW-108-07-G-D-Samtec-datasheet-63880566.pdf?src-supplier=Newark; ComponentLink4Description: https://datasheet.octopart.com:443/TSW-108-07-G-D-Samtec-datasheet-63880566.pdf?src-supplier=Newark; ComponentLink5URL: https://datasheet.octopart.com:443/TSW-108-07-G-D-Samtec-datasheet-11047283.pdf?src-supplier=Newark; ComponentLink5Description: https://datasheet.octopart.com:443/TSW-108-07-G-D-Samtec-datasheet-11047283.pdf?src-supplier=Newark; ComponentLink6URL: https://datasheet.octopart.com:443/TSW-108-07-G-D-Samtec-datasheet-136646178.pdf?src-supplier=Master+Electronics; ComponentLink6Description: https://datasheet.octopart.com:443/TSW-108-07-G-D-Samtec-datasheet-136646178.pdf?src-supplier=Master+Electronics; ComponentLink7URL: https://datasheet.octopart.com:443/TSW-108-07-G-D-Samtec-datasheet-116615235.pdf?src-supplier=Master+Electronics; ComponentLink7Description: https://datasheet.octopart.com:443/TSW-108-07-G-D-Samtec-datasheet-116615235.pdf?src-supplier=Master+Electronics; ComponentLink8URL: https://datasheet.octopart.com:443/TSW-108-07-G-D-Samtec-datasheet-62107121.pdf?src-supplier=Farnell; ComponentLink8Description: https://datasheet.octopart.com:443/TSW-108-07-G-D-Samtec-datasheet-62107121.pdf?src-supplier=Farnell; ComponentLink9URL: https://datasheet.octopart.com:443/TSW-108-07-G-D-Samtec-datasheet-182948906.pdf?src-supplier=JRH+Electronics; ComponentLink9Description: https://datasheet.octopart.com:443/TSW-108-07-G-D-Samtec-datasheet-182948906.pdf?src-supplier=JRH+Electronics; ComponentLink10URL: https://datasheet.octopart.com:443/TSW-108-07-G-D-Samtec-datasheet-160657603.pdf?src-supplier=Toby+Electronics; ComponentLink10Description: https://datasheet.octopart.com:443/TSW-108-07-G-D-Samtec-datasheet-160657603.pdf?src-supplier=Toby+Electronics; ComponentLink11URL: https://datasheet.octopart.com:443/TSW-108-07-G-D-Samtec-datasheet-116539033.pdf?src-supplier=Toby+Electronics; ComponentLink11Description: https://datasheet.octopart.com:443/TSW-108-07-G-D-Samtec-datasheet-116539033.pdf?src-supplier=Toby+Electronics; ComponentLink12URL: https://datasheet.octopart.com:443/TSW-108-07-G-D-Samtec-datasheet-116536310.pdf?src-supplier=Toby+Electronics; ComponentLink12Description: https://datasheet.octopart.com:443/TSW-108-07-G-D-Samtec-datasheet-116536310.pdf?src-supplier=Toby+Electronics; ComponentLink13URL: https://datasheet.octopart.com/TSW-108-07-G-D-Samtec-datasheet-86818365.pdf; ComponentLink13Description: https://datasheet.octopart.com/TSW-108-07-G-D-Samtec-datasheet-86818365.pdf; ComponentLink14URL: https://datasheet.octopart.com:443/TSW-108-07-G-D-Samtec-datasheet-5313500.pdf?src-supplier=_legacy+Avnet; ComponentLink14Description: https://datasheet.octopart.com:443/TSW-108-07-G-D-Samtec-datasheet-5313500.pdf?src-supplier=_legacy+Avnet
H4 = TSW-103-07-G-D: CONN HEADER VERT 6POS 2.54MM; Manufacturer: Samtec; Manufacturer Lifecycle Status: PRODUCTION; Connector Type: Male Pin; Gender: Male; Max Current Rating: 7.6A; Max Voltage Rating (AC): 550V; Number of Contacts: 6; Supplier: DigiKey; Supplier Part Number: 612-TSW-103-07-G-D-ND; Manufacturer Part Number: TSW-103-07-G-D; RoHS: Compliant; Category: Headers and Wire Housings; Stock: 10228; Pricing: 1=0.58, 10=0.495, 100=0.4209, 500=0.37568, 1000=0.35773, 5000=0.31932, 10000=0.30409 (USD); Color: Black; Contact Material: Bronze; Contact Mating Length: 5.842mm; Contact Plating: Gold; Depth: 5.08mm; Housing Color: Black; Housing Material: Polyester; Lead Free: Lead Free; Lead Pitch: 2.54mm; Lifecycle Status: Production; Max Operating Temperature: 125°C; Min Operating Temperature: -55°C; Mounting Technology: Through Hole; Pins: 6; Number of Positions: 6; Number of Rows: 2; Orientation: Straight; Packaging: Bulk; Pitch: 2.54mm; Radiation Hardening: No; REACH SVHC: Unaffected; Row Spacing: 2.54mm; Termination: Solder; Width: 5.08mm; ComponentLink1URL: https://datasheet.octopart.com:443/TSW-103-07-G-D-Samtec-datasheet-97325576.pdf?src-supplier=Newark; ComponentLink1Description: https://datasheet.octopart.com:443/TSW-103-07-G-D-Samtec-datasheet-97325576.pdf?src-supplier=Newark; ComponentLink2URL: https://sigma.octopart.com:443/97325577/technical_drawing/Samtec-TSW-103-07-G-D.pdf?src-supplier=HQonline; ComponentLink2Description: https://sigma.octopart.com:443/97325577/technical_drawing/Samtec-TSW-103-07-G-D.pdf?src-supplier=HQonline; ComponentLink3URL: https://datasheet.octopart.com:443/TSW-103-07-G-D-Samtec-datasheet-62107121.pdf?src-supplier=Farnell; ComponentLink3Description: https://datasheet.octopart.com:443/TSW-103-07-G-D-Samtec-datasheet-62107121.pdf?src-supplier=Farnell; ComponentLink4URL: https://datasheet.octopart.com:443/TSW-103-07-G-D-Samtec-datasheet-150856372.pdf?src-supplier=Electro+Sonic; ComponentLink4Description: https://datasheet.octopart.com:443/TSW-103-07-G-D-Samtec-datasheet-150856372.pdf?src-supplier=Electro+Sonic; ComponentLink5URL: https://datasheet.octopart.com:443/TSW-103-07-G-D-Samtec-datasheet-116615235.pdf?src-supplier=Electro+Sonic; ComponentLink5Description: https://datasheet.octopart.com:443/TSW-103-07-G-D-Samtec-datasheet-116615235.pdf?src-supplier=Electro+Sonic; ComponentLink6URL: https://datasheet.octopart.com:443/TSW-103-07-G-D-Samtec-datasheet-11047283.pdf?src-supplier=element14+APAC; ComponentLink6Description: https://datasheet.octopart.com:443/TSW-103-07-G-D-Samtec-datasheet-11047283.pdf?src-supplier=element14+APAC; ComponentLink7URL: https://datasheet.octopart.com:443/TSW-103-07-G-D-Samtec-datasheet-182948906.pdf?src-supplier=JRH+Electronics; ComponentLink7Description: https://datasheet.octopart.com:443/TSW-103-07-G-D-Samtec-datasheet-182948906.pdf?src-supplier=JRH+Electronics; ComponentLink8URL: https://datasheet.octopart.com:443/TSW-103-07-G-D-Samtec-datasheet-160657603.pdf?src-supplier=Toby+Electronics; ComponentLink8Description: https://datasheet.octopart.com:443/TSW-103-07-G-D-Samtec-datasheet-160657603.pdf?src-supplier=Toby+Electronics; ComponentLink9URL: https://datasheet.octopart.com:443/TSW-103-07-G-D-Samtec-datasheet-116539033.pdf?src-supplier=Toby+Electronics; ComponentLink9Description: https://datasheet.octopart.com:443/TSW-103-07-G-D-Samtec-datasheet-116539033.pdf?src-supplier=Toby+Electronics; ComponentLink10URL: https://datasheet.octopart.com:443/TSW-103-07-G-D-Samtec-datasheet-116536310.pdf?src-supplier=Toby+Electronics; ComponentLink10Description: https://datasheet.octopart.com:443/TSW-103-07-G-D-Samtec-datasheet-116536310.pdf?src-supplier=Toby+Electronics; ComponentLink11URL: https://datasheet.octopart.com:443/TSW-103-07-G-D-Samtec-datasheet-151455181.pdf?src-supplier=Sager+Electronics; ComponentLink11Description: https://datasheet.octopart.com:443/TSW-103-07-G-D-Samtec-datasheet-151455181.pdf?src-supplier=Sager+Electronics; ComponentLink12URL: https://datasheet.octopart.com/TSW-103-07-G-D-Samtec-datasheet-86818365.pdf; ComponentLink12Description: https://datasheet.octopart.com/TSW-103-07-G-D-Samtec-datasheet-86818365.pdf; ComponentLink13URL: https://datasheet.octopart.com:443/TSW-103-07-G-D-Samtec-datasheet-5313500.pdf?src-supplier=_legacy+Avnet; ComponentLink13Description: https://datasheet.octopart.com:443/TSW-103-07-G-D-Samtec-datasheet-5313500.pdf?src-supplier=_legacy+Avnet